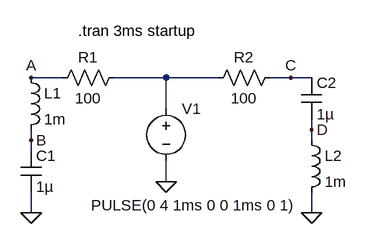
[diagram p0: schematic DemotLT2.asc]
DemotLT2.asc, the LTspice schematic file:
Version 4
SHEET 1 880 680
WIRE 128 128 80 128
WIRE 288 128 208 128
WIRE 368 128 288 128
WIRE 480 128 448 128
WIRE 512 128 480 128
WIRE 288 176 288 128
WIRE 512 208 512 192
WIRE 80 224 80 208
WIRE 512 224 512 208
WIRE 80 240 80 224
WIRE 288 288 288 256
WIRE 80 336 80 304
WIRE 512 336 512 304
FLAG 80 336 0
FLAG 512 336 0
FLAG 288 288 0
FLAG 80 128 A
FLAG 80 224 B
FLAG 480 128 C
FLAG 512 208 D
SYMBOL res 224 112 R90
WINDOW 0 0 56 VBottom 2
WINDOW 3 32 56 VTop 2
SYMATTR InstName R1
SYMATTR Value 100
SYMBOL res 464 112 R90
WINDOW 0 0 56 VBottom 2
WINDOW 3 32 56 VTop 2
SYMATTR InstName R2
SYMATTR Value 100
SYMBOL ind 64 112 R0
SYMATTR InstName L1
SYMATTR Value 1m
SYMBOL ind 496 208 R0
SYMATTR InstName L2
SYMATTR Value 1m
SYMBOL cap 64 240 R0
SYMATTR InstName C1
SYMATTR Value 1µ
SYMBOL cap 496 128 R0
SYMATTR InstName C2
SYMATTR Value 1µ
SYMBOL voltage 288 160 R0
WINDOW 3 -116 164 Left 2
WINDOW 123 0 0 Left 2
WINDOW 39 0 0 Left 2
SYMATTR InstName V1
SYMATTR Value PULSE(0 4 1ms 0 0 1ms 0 1)
TEXT 152 56 Left 2 !.tran 3ms startup

The netlist it stands for:
* DemotLT2.asc
R1 N001 A 100
R2 C N001 100
L1 A B 1m
L2 D 0 1m
C1 B 0 1µ
C2 C D 1µ
V1 N001 0 PULSE(0 4 1ms 0 0 1ms 0 1)
.tran 3ms startup
.backanno
.end

* Results of the author's LTspice run, read from the files saved beside the schematic
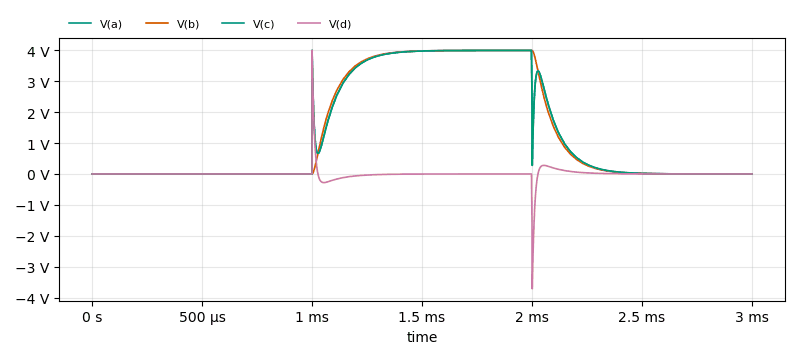
[diagram p1: Transient Analysis of DemotLT2.asc, plotted from the saved traces]
* Transient Analysis, 1 run:
*   V(a): min 0 V, max 4 V, average 1.333 V, rms 2.19 V, last 65.96 µV
*   V(b): min 0 V, max 4 V, average 1.334 V, rms 2.203 V, last 58.53 µV
*   V(c): min 0 V, max 4.002 V, average 1.333 V, rms 2.19 V, last 65.96 µV
*   V(d): min -3.718 V, max 4.002 V, average -710.9 µV, rms 234.9 mV, last 7.433 µV